# Altium schematic sheet TC_TouchSwitch.SchDoc
size A4
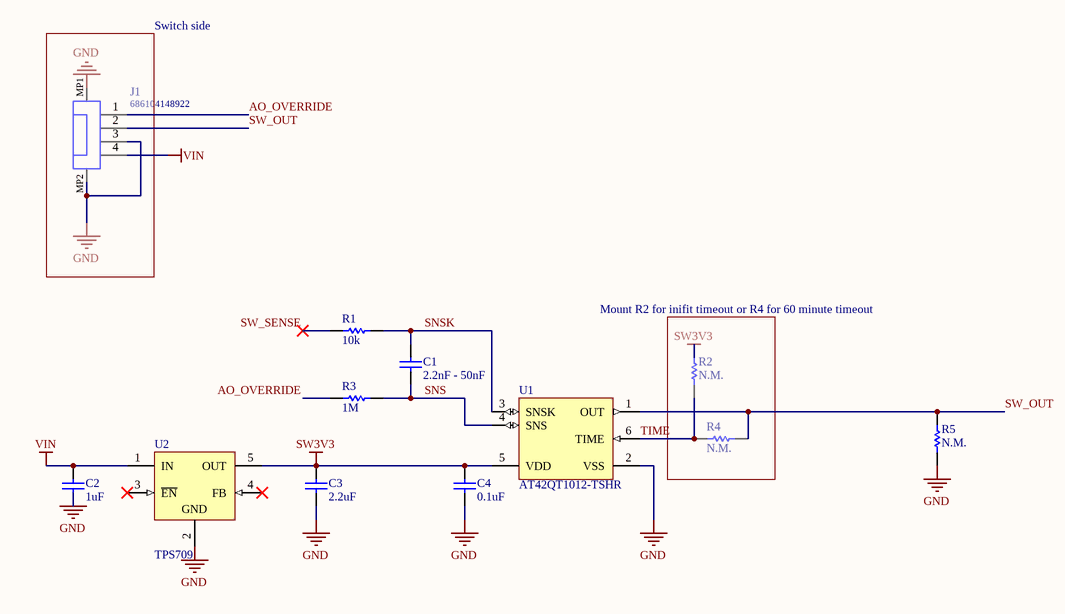
[diagram p0: TC_TouchSwitch.SchDoc]

## Parts
C1  2.2nF - 50nF  [CAPC1608X90X35ML10T15]
C2  1uF  [CAPC1608X90X20LL10]
C3  2.2uF  [CAPC1608X90X35ML10T15]
C4  0.1uF  [CAPC1608X87X35NL15T15]
J1  686104148922  [686104148922]
R1  10k  [RESC1609X55X30LL15T15]
R2  N.M.  [RESC1608X55X25ML10T15]
R3  1M  [RESC1609X50X30LL10T20]
R4  N.M.  [RESC1608X55X25ML10T15]
R5  N.M.  [RESC1608X55X25ML10T15]
U1  AT42QT1012-TSHR  [6ST1_M]
U2  TPS709  [DBV0005A_M]

## Blocks framed on the sheet
Switch side: J1

## Nets
GND: C2.1 C3.1 C4.2 J1.3 J1.MP1 J1.MP2 R5.1 U1.2(VSS) U2.2(GND)
SW3V3: C3.2 C4.1 R2.2 U1.5(VDD) U2.5(OUT)
VIN: C2.2 J1.4 U2.1(IN)
AO_OVERRIDE: J1.1 R3.2
SNS: C1.1 R3.1 U1.4(SNS)
SNSK: C1.2 R1.2 U1.3(SNSK)
SW_OUT: J1.2 R4.1 R5.2 U1.1(OUT)
SW_SENSE: R1.1
TIME: R2.1 R4.2 U1.6(TIME)

Not connected (* = marked no-connect by the designer): U2 3(~{EN})* 4(FB)*

## Notes on the sheet
- (near R2) Mount R2 for inifit timeout or R4 for 60 minute timeout

## Library data of the parts
C1 = CMP-2100-03642-1: Chip Capacitor, 10 nF, +/- 10%, 50 V, -55 to 125 degC, 0603 (1608 Metric), RoHS, Tape and Reel; Manufacturer: Murata; Insulation Resistance: 10GR; Dielectric: X7R; Voltage Rating: 50V; Capacitance: 10nF; Material: Ceramic; Package Quantity: 1; Lead Free: LeadFree; Case/Package: 0603; Termination: SMD/SMT; REACH SVHC: Unknown; Manufacturer URL: http://www.murata.com/; Datasheet URL: http://search.murata.co.jp/Ceramy/image/img/A01X/G101/ENG/GRM188R71H103KA01-01.pdf; Mount: SurfaceMount; Datasheet Version: 42401.0; Number of Pins: 2; Length: 1.6mm; Voltage: 50V; Depth: 0.8mm; Tolerance: 10%; Min Operating Temperature: -55degC; Voltage Rating (DC): 50V; Max Operating Temperature: 125degC; Package Description: 2-Pin Surface Mount Device, Body 1.6 x 0.8 mm; RoHSCompliant: True; Case Code (Imperial): 0603; Width: 0.031inch; Case Code (Metric): 1608; Height: 0.8mm; Package Reference: 0603; Packaging: TapeandReel; Thickness: 0.035inch; Dielectric Material: Ceramic
C2 = CMP-2000-06025-1: Chip Capacitor, 1 uF, +/- 10%, 50 V, -55 to 85 degC, 0603 (1608 Metric), RoHS, Tape and Reel; Manufacturer: TDK; PCN Part Number: MLCCPartNumberChange30/Nov/2012; Other Names: 445-7468-6; Online Catalog: CSeries,GeneralPurpose; Capacitance: 1µF; Product Training Modules: CSeriesGeneralApplicationsSEAT,CCV,andTVCLDesignToolsGuidetoReplacinganElectrolyticCapacitorwithanMLCC; Voltage - Rated: 50V; Design Resources: 20WNon-IsolatedBuckLEDDriverUsingPLLNK460KG; Temperature Coefficient: X5R; Series: C; Datasheet Version: 08/2016; Package Description: 2-Pin Surface Mount Device, Body 1.6 x 0.8 mm; Mounting Technology: SurfaceMount; Features: -; Size / Dimension: 0.063"Lx0.031"W(1.60mmx0.80mm); Lead Spacing: -; Operating Temperature: -55°C~85°C; Tolerance: ±10%; Height - Seated (Max): -; Mounting Type: SurfaceMount,MLCC; Ratings: -; Standard Package: 1; Applications: GeneralPurpose; Datasheet URL: https://product.tdk.com/info/en/catalog/datasheets/mlcc_commercial_general_en.pdf; Category: Capacitors; Lead Style: -; Packaging: Digi-Reel®; RoHS Information: RoHSCertificate-MLCC; Package / Case: 0603(1608Metric); Package Reference: 0603; Manufacturer URL: http://www.tdk.com/; Thickness (Max): 0.035"(0.90mm); Family: CeramicCapacitors
C3 = CMP-2006-02836-1: Manufacturer: Murata; Part Number: GRM188R71A225KE15D
C4 = CMP-2006-03300-1: Part Number: C0603X104K5RACTU; Manufacturer: Kemet
J1 = CMP-1502-01512-1: SMT ZIF Connectors Hinge Type WR-FPC, Horizontal, Bottom Contact, pitch 1 mm, 4 pins; Manufacturer: Wurth Elektronik; Contact Resistance: 50mOhm; Withstanding Voltage: 500VAC; Working Voltage: 100VAC; Pitch: 1mm; Rated Current: 1A; Pin Number: 4; Operating Temperature: -40to105degC; Part Number: 686104148922; Packaging: TapeandReel; Package Reference: 686104148922; Datasheet URL: https://katalog.we-online.de/em/datasheet/686104148922.pdf; Mounting Technology: SMT; Manufacturer URL: http://www.we-online.de; Contact Design: BottomContact; Orientation: Horizontal; Publisher: WurthElektronik
R1 = CMP-2000-07452-1: Chip Resistor, 10 KOhm, +/- 1%, 0.1 W, -55 to 155 degC, 0603 (1608 Metric), RoHS, Tape and Reel; Manufacturer: Panasonic; Voltage Rating: 75V; Case\/Package: 0603; Power Rating: 100mW; Resistance: 10KOhm; Temperature Coefficient: 100ppm\/degreesC; Number of Pins: 2; Package Reference: 603; Depth: 0.8mm; Mount: SurfaceMount; Package Description: 2-Pin Surface Mount Device, Body 1.6 x 0.85 mm; Datasheet Version: 02/2017; Length: 1.6mm; Lead Free: LeadFree; Height: 0.45mm; Number of Terminations: 2; Max Power Dissipation: 100mW; Min Operating Temperature: -55degC; Datasheet URL: https://industrial.panasonic.com/cdbs/www-data/pdf/RDA0000/AOA0000C304.pdf; Termination: SMD/SMT; Case Code (Metric): 1608; Case Code (Imperial): 0603; Tolerance: 1%; Max Operating Temperature: 155degC; RoHSCompliant: true; Voltage Rating (DC): 75V; Radiation Hardening: No; Packaging: TapeandReel; Composition: ThickFilm; Mounting Technology: SurfaceMount; Manufacturer URL: http://www.panasonic.com/; Width: 0.031inch; REACH SVHC: NoSVHC; Contact Plating: Tin; Military Standard: Not; Package Quantity: 1
R2 R4 R5 = CMP-2100-03662-1: Chip Resistor, 100 KOhm, +/- 1%, 0.1 W, -55 to 155 degC, 0603 (1608 Metric), RoHS, Tape and Reel; Manufacturer: Yageo; Power Rating: 100mW; Voltage Rating: 50V; Temperature Coefficient: 100ppm/degreesC; Datasheet Version: Rev. 5, 10/2016; Height: 0.45mm; Lead Free: LeadFree; Manufacturer URL: http://www.yageo.com/; Package Reference: 0603; Depth: 0.8mm; RoHSCompliant: true; Composition: ThickFilm; Military Standard: Not; Resistance: 100KOhm; Case/Package: 0603; Packaging: TapeandReel; Case Code (Imperial): 0603; Voltage Rating (DC): 50V; Case Code (Metric): 1608; Tolerance: 1%; Termination: SMD/SMT; Min Operating Temperature: -55degC; Number of Pins: 2; Length: 1.6mm; Width: 0.8mm; Datasheet URL: http://www.yageo.com/NewPortal/yageodocoutput?fileName=/pdf/R-Chip/PYu-RC_Group_51_RoHS_L_5.pdf; Package Description: 2-Pin Surface Mount Device, Body 1.6 x 0.8 mm; Max Operating Temperature: 155degC; REACH SVHC: NoSVHC
R3 = CMP-2000-03013-1: Manufacturer: Vishay Dale; Part Number: CRCW06031M00FKEA
U1 = CMP-0073-00037-1: One-channel Toggle-mode Touch Sensor IC with Power Management Functions, -40° to +85° C, 6-pin SOT23; Code_IPC: SOT26A-6; ComponentLink2URL: http://www.atmel.com/Images/doc9543.pdf; ComponentLink2Description: Datasheet; ComponentLink1URL: http://www.atmel.com/; Code_JEDEC: MO-178-AB; PackageReference: 6ST1; DatasheetVersion: revD, Aug-2010; PackageVersion: revA, Jun-2008; ComponentLink1Description: Manufacturer URL; PackageDescription: 6-Lead, 2.90 x 1.60 mm Plastic Small Outline Package (SOT23)
U2 = CMP-0394-00329-2: Single Output LDO, 100 mA, Adjustable 1.2 to 5.5 V Output, 2.7 to 10 V Input, with Low IQ, 5-pin SOT-23 (DBV), -40 to 125 degC, Green (RoHS & no Sb/Br); PartNumber: TPS76901DBVR; Manufacturer: Texas Instruments; Vin(Min)(V): 2.7; Vin(Max)(V): 10; SubFamily: Single Channel LDO; Rating: Catalog; Vdo(Typ)(mV): 71; Vout Adj(Max)(V): 5.5; Accuracy(%): 3; Vout Adj(Min)(V): 1.2; Iout(Max)(A): 0.1; Iq(Typ)(mA): 0.02; ComponentLink1Description: Manufacturer URL; ComponentLink3URL: http://www.ti.com/litv/pdf/mpds018i; DatasheetVersion: SLVS203E; ComponentLink2URL: http://www.ti.com/general/docs/lit/getliterature.tsp?genericPartNumber=TPS76901&fileType=pdf; PackageVersion: 4073253-4/K; PackageDescription: 5-Pin Plastic Small Outline, Body 1.60 Ãƒâ€” 2.90 mm, Pitch 0.95 mm; Eco-Plan: Green (RoHS & no Sb/Br); ComponentLink4URL: Samples URL:http://www.ti.com/product/tps76901#samples; ComponentLink1URL: http://www.ti.com/; PackageReference: DBV0005A; ComponentLink4Description: URL Link1; Code_JEDEC: MO-178; ComponentLink2Description: Datasheet; Mounting Technology: Surface Mount; ComponentLink3Description: Package Specification